# EAGLE design USBSocket_Type9_v1.0 (EAGLE 9.6.2)
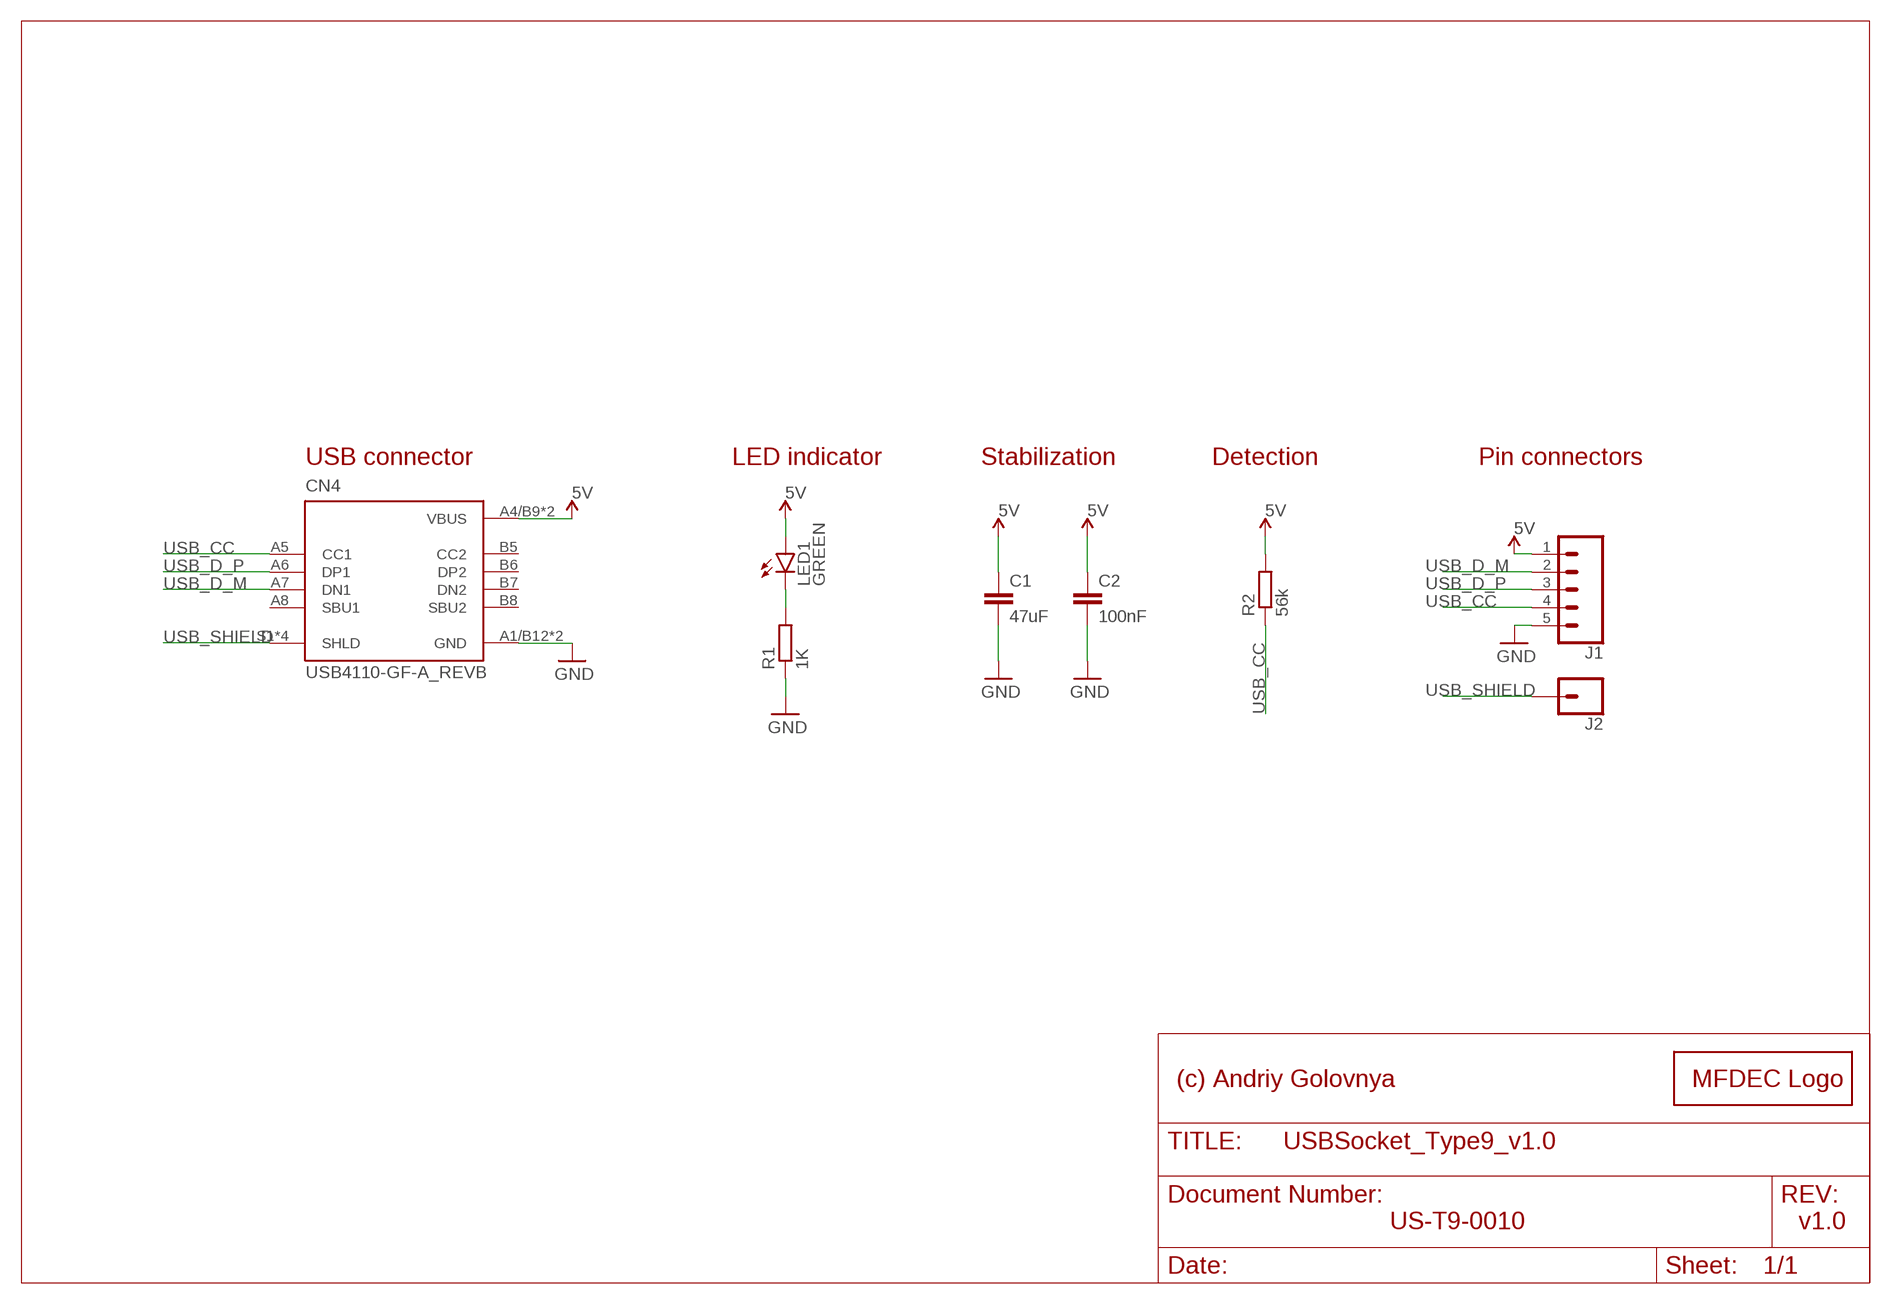
[diagram p0: schematic, sheet 1]

## Parts
C1  47uF  C-EUC0805  [C0805]
C2  100nF  C-EUC0402  [C0402]
CN4  USB4110-GF-A_REVB  [GCT_USB4110-GF-A_REVB]
J1  CONN_05PTH  [1X05]
J2  CONN_01  [1X01]
LED1  GREEN  LEDSML0603  [SML0603]
LOGO1  MFDECLOGO_L_10MM  [MFDEC_L_10MM]
R1  1K  R-EU_R0402  [R0402]
R2  56k  R-EU_R0402  [R0402]

## Nets
5V [POWER]: C1.1 C2.1 CN4.A4/B9(VBUS) CN4.B4/A9(VBUS) J1.1 LED1.A R2.2
GND [POWER]: C1.2 C2.2 CN4.A1/B12(GND) CN4.B1/A12(GND) J1.5 R1.1
N$7: LED1.C R1.2
USB_CC: CN4.A5(CC1) J1.4 R2.1
USB_D_M [XUSB]: CN4.A7(DN1) J1.2
USB_D_P [XUSB]: CN4.A6(DP1) J1.3
USB_SHIELD: CN4.S1(SHLD) CN4.S2(SHLD) CN4.S3(SHLD) CN4.S4(SHLD) J2.1
Unconnected: CN4.A8(SBU1) CN4.B5(CC2) CN4.B6(DP2) CN4.B7(DN2) CN4.B8(SBU2)

## Notes on the sheet
- USB connector | LED indicator | Stabilization | Detection | Pin connectors
- (c) Andriy Golovnya
- US-T9-0010 | v1.0

## Library data of the parts
C1 C2 = rcl:C-EU: CAPACITOR, European symbol; SPICEPREFIX: C
CN4 = USB4110-GF-A_REVB:USB4110-GF-A_REVB: Check availability <https://pricing.snapeda.com/parts/USB4110-GF-A/GCT/view-part?ref=eda>; AVAILABILITY: In Stock; DESCRIPTION: USB-C (USB TYPE-C) USB 2.0 Receptacle Connector 24 (16+8 Dummy) Position Surface Mount, Right Angle; Through Hole; MF: GCT; MP: USB4110-GF-A; PACKAGE: None; PRICE: None; PURCHASE-URL: https://pricing.snapeda.com/search/part/USB4110-GF-A/?ref=eda
J1 = _my_locked_connectors:CONN_05: Multi connection point. Often used as Generic Header-pin footprint for 0.1 inch spaced/style header connections On any of the 0.1 inch spaced packages, you can populate with these: Break Away Headers - Straight <https://www.sparkfun.com/products/116> (PRT-00116) Break Away Male Headers - Right Angle <https://www.sparkfun.com/products/553> (PRT-00553) Female Headers <https://www.sparkfun.com/products/115> (PRT-00115) Break Away Headers - Machine Pin <https://www.sparkfun.com/products/117> (PRT-00117) Break Away Female Headers - Swiss Machine Pin <https://www.sparkfun.com/products/743> (PRT-00743) For SCREWTERMINALS and SPRING TERMINALS visit here: Screw Terimnals on SparkFun.com <https://www.sparkfun.com/search/results?term=Screw+Terminals> (5mm/3.5mm/2.54mm spacing) This device is also useful as a general connection point to wire up your design to another part of your project. Our various solder wires solder well into these plated through hole pads. Hook-Up Wire - Assortment (Stranded, 22 AWG) <https://www.sparkfun.com/products/11375> (PRT-11375) Hook-Up Wire - Assortment (Solid Core, 22 AWG) <https://www.sparkfun.com/products/11367> (PRT-11367) View the entire wire category on our website here <https://www.sparkfun.com/categories/141> Special notes: Molex polarized connector foot print use with SKU : PRT-08231 with associated crimp pins and housings. 1MM SMD Version SKU: PRT-10208
J2 = SparkFun-Connectors:CONN_01: Single connection point. Often used as Generic Header-pin footprint for 0.1 inch spaced/style header connections On any of the 0.1 inch spaced packages, you can populate with these: Break Away Headers - Straight <https://www.sparkfun.com/products/116> (PRT-00116) Break Away Male Headers - Right Angle <https://www.sparkfun.com/products/553> (PRT-00553) Female Headers <https://www.sparkfun.com/products/115> (PRT-00115) Break Away Headers - Machine Pin <https://www.sparkfun.com/products/117> (PRT-00117) Break Away Female Headers - Swiss Machine Pin <https://www.sparkfun.com/products/743> (PRT-00743) This device is also useful as a general connection point to wire up your design to another part of your project. Our various solder wires solder well into these plated through hole pads. Hook-Up Wire - Assortment (Stranded, 22 AWG) <https://www.sparkfun.com/products/11375> (PRT-11375) Hook-Up Wire - Assortment (Solid Core, 22 AWG) <https://www.sparkfun.com/products/11367> (PRT-11367) View the entire wire category on our website here <https://www.sparkfun.com/categories/141> Special notes: SMTSO-256-ET is a "flush mount" nut for a 4-40 screw. We mostly use this on specialty testbeds; it is a nice way to connect hardware to your PCB at an adjustable hieght. Also note, the SNAP packages are for using a snappable style connector. We sell a baggie of snaps and they are also used on two LilyPad designs: Snap Assortment - 30 pack (male and female) <https://www.sparkfun.com/products/11347> (DEV-11347) LilyPad Arduino SimpleSnap <https://www.sparkfun.com/products/10941> (DEV-10941) LilyPad SimpleSnap Protoboard <https://www.sparkfun.com/products/10940> (DEV-10940)
LED1 = led:LED: LED OSRAM: - CHIPLED LG R971, LG N971, LY N971, LG Q971, LY Q971, LO R971, LY R971 LH N974, LH R974 LS Q976, LO Q976, LY Q976 LO Q996 - Hyper CHIPLED LW Q18S LB Q993, LB Q99A, LB R99A - SideLED LS A670, LO A670, LY A670, LG A670, LP A670 LB A673, LV A673, LT A673, LW A673 LH A674 LY A675 LS A676, LA A676, LO A676, LY A676, LW A676 LS A679, LY A679, LG A679 - Hyper Micro SIDELED® LS Y876, LA Y876, LO Y876, LY Y876 LT Y87S - SmartLED LW L88C, LW L88S LB L89C, LB L89S, LG L890 LS L89K, LO L89K, LY L89K LS L896, LA L896, LO L896, LY L896 - TOPLED LS T670, LO T670, LY T670, LG T670, LP T670 LSG T670, LSP T670, LSY T670, LOP T670, LYG T670 LG T671, LOG T671, LSG T671 LB T673, LV T673, LT T673, LW T673 LH T674 LS T676, LA T676, LO T676, LY T676, LB T676, LH T676, LSB T676, LW T676 LB T67C, LV T67C, LT T67C, LS T67K, LO T67K, LY T67K, LW E67C LS E67B, LA E67B, LO E67B, LY E67B, LB E67C, LV E67C, LT E67C LW T67C LS T679, LY T679, LG T679 LS T770, LO T770, LY T770, LG T770, LP T770 LB T773, LV T773, LT T773, LW T773 LH T774 LS E675, LA E675, LY E675, LS T675 LS T776, LA T776, LO T776, LY T776, LB T776 LHGB T686 LT T68C, LB T68C - Hyper Mini TOPLED® LB M676 - Mini TOPLED Santana® LG M470 LS M47K, LO M47K, LY M47K Source: http://www.osram.convergy.de LUXEON: - LUMILED® LXK2-PW12-R00, LXK2-PW12-S00, LXK2-PW14-U00, LXK2-PW14-V00 LXK2-PM12-R00, LXK2-PM12-S00, LXK2-PM14-U00 LXK2-PE12-Q00, LXK2-PE12-R00, LXK2-PE12-S00, LXK2-PE14-T00, LXK2-PE14-U00 LXK2-PB12-K00, LXK2-PB12-L00, LXK2-PB12-M00, LXK2-PB14-N00, LXK2-PB14-P00, LXK2-PB14-Q00 LXK2-PR12-L00, LXK2-PR12-M00, LXK2-PR14-Q00, LXK2-PR14-R00 LXK2-PD12-Q00, LXK2-PD12-R00, LXK2-PD12-S00 LXK2-PH12-R00, LXK2-PH12-S00 LXK2-PL12-P00, LXK2-PL12-Q00, LXK2-PL12-R00 Source: www.luxeon.com KINGBRIGHT: KA-3528ASYC Source: www.kingbright.com
LOGO1 = _my_logos:MFDECLOGO: Midnight Fog - Digital Eye Candy LOGO
R1 R2 = rcl:R-EU_: RESISTOR, European symbol; SPICEPREFIX: R

## Net classes
1 XUSB: width 0.305 mm
2 USB: width 0.305 mm
3 POWER: width 0.305 mm

## Board
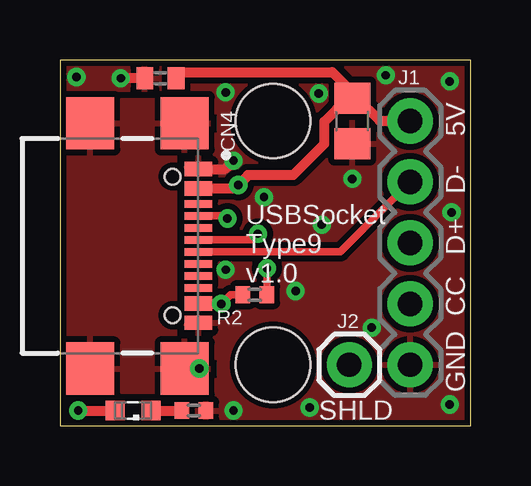
[diagram p1: board, top side]
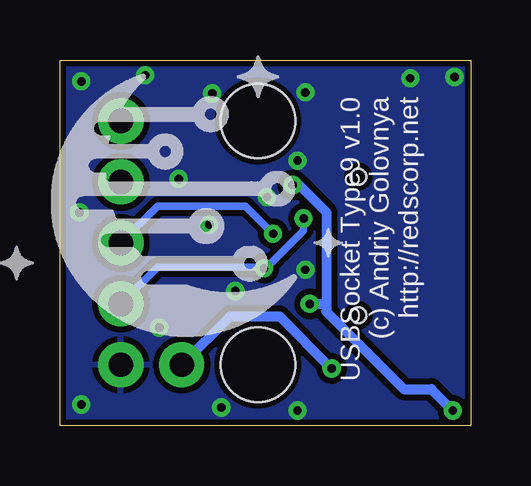
[diagram p2: board, bottom side, seen from below]

Size 17.14 x 15.24 mm. Coordinates in mm from the lower left corner, seen from the top.
Outline: 0,0 17.14,0 17.14,15.24 0,15.24 0,0
Copper layers (1*16): Top 0.035mm / dielectric 1.5mm / Bottom 0.035mm
Design rules "default *": minimum track width 6mil, minimum drill 0.35mm, track to track 6mil, track to pad 6mil, pad to pad 6mil, via to via 6mil, smd to smd 6mil, copper to edge 10mil, drill to drill 6mil, minimum pad ring 10mil, minimum via ring 8mil, stop-mask expansion 4mil, vias tented up to drill 20mil, thermal gap 10mil
Holes 3.1 mm at 8.89,2.54 8.89,12.7

### Footprints (pad centres in the part's own frame; a part is rotated, then mirrored left to right if it is on the bottom)
C0805 = smd 1.3 x 1.5: 1 -0.95,0; 2 0.95,0
C0402 = smd 0.7 x 0.9: 1 -0.65,0; 2 0.65,0
GCT_USB4110-GF-A_REVB = smd 0.6 x 1.15: A1/B12 -3.2,1.075; A4/B9 -2.4,1.075; B1/A12 3.2,1.075; B4/A9 2.4,1.075 | smd 0.3 x 1.15: A5 -1.25,1.075; A6 -0.25,1.075; A7 0.25,1.075; A8 1.25,1.075; B5 1.75,1.075; B6 0.75,1.075; B7 -0.75,1.075; B8 -1.75,1.075 | smd 2.18 x 2: S1 -5.11,0.5; S2 5.11,0.5; S3 -5.11,-3.43; S4 5.11,-3.43 | hole 0.65: -2.89,0; 2.89,0
1X05 = drill 1.016 pad 1.88: 1 0,0; 2 2.54,0; 3 5.08,0; 4 7.62,0; 5 10.16,0
1X01 = drill 1.016 pad 1.88: 1 0,0
SML0603 = smd 0.8 x 0.8: A 0.75,0; C -0.75,0
R0402 = smd 0.6 x 0.7: 1 -0.5,0; 2 0.5,0

### Placement (x,y rotation side)
C1  12.19,12.7 270 top
C2  4.19,14.48 180 top
CN4  4.7,7.49 270 top
J1  14.61,12.7 270 top
J2  12.06,2.54 0 top
LED1  3.05,0.64 180 top
LOGO1  20.45,2.79 0 bottom  (outside the outline)
R1  5.59,0.64 180 top
R2  8.13,5.46 180 top

### Tracks (layer width: path | path; a pad name or v marks a point on that pad's centre or on a via)
5V  (via drill 0.35)
  Top 0.305: v6.73,5.08 7.11,5.46 R2.2
  Top 0.406: C1.1 12,13.65 11.02,12.68 11.02,11.74 9.72,10.44 7.84,10.44 v7.44,10.03 7.3,9.89 CN4.A4/B9 | C2.1 4.84,14.54 5.04,14.73 11.36,14.73 12.19,13.9 C1.1 | C1.1 12.38,13.65 13.34,12.7 J1.1 | CN4.B4/A9 6.72,5.09 v6.73,5.08 | v0.76,0.64 LED1.A
  Bottom 0.406: v7.44,10.03 7.18,10.03 6.04,8.89 6.04,5.08 | 6.04,5.08 6.04,4.75 2.81,1.52 1.65,1.52 v0.76,0.64 | v6.73,5.08 6.04,5.08
GND  (via drill 0.35)
  Top 0.406: C2.2 v2.54,14.48 | CN4.A1/B12 6.88,10.69 v7.24,11.05
  other vias: 13,4.09 7.24,0.64 16.26,0.89 16.26,14.35 16.33,8.89 8.51,9.53 12.19,10.29 6.91,13.89 10.79,13.84 10.41,0.76 13.59,14.61 10.92,8.38 6.91,6.5 9.83,5.61 0.69,14.53
  pour Top (isolate 0.254, rank 2): 0.13,0 23.24,0 23.24,15.24 0.13,15.24
  pour Bottom (isolate 0.254, rank 2): 0.13,0 20.07,0 20.07,15.24 0.13,15.24
N$7
  Top 0.406: LED1.C R1.2
USB_CC  (via drill 0.35)
  Top 0.305: CN4.A5 6.88,8.74 v6.99,8.64 | v8.64,6.56 8.63,6.55 R2.1
  Bottom 0.305: v6.99,8.64 6.99,8.13 8.51,6.6 8.64,6.6 | J1.4 13.08,6.6 8.64,6.6 | v8.64,6.56 8.64,6.6
USB_D_M
  Top 0.305: J1.2 11.69,7.24 CN4.A7
USB_D_P  (via drill 0.35)
  Top 0.305: CN4.A6 8,7.74 v8.26,8
  Bottom 0.305: v8.26,8 9.4,9.14 13.08,9.14 J1.3
USB_SHIELD  (via drill 0.35)
  Top 0.406: v5.81,2.38 CN4.S2
  Bottom 0.406: v5.81,2.38 7.98,4.55 10.06,4.55 J2.1
  pour Top (isolate 0.254): 4.83,11.43 6.22,11.43 6.22,13.59 0.13,13.59 0.13,1.4 6.22,1.4 6.22,3.56 4.83,3.56

### Text on the board
tPlace: 5V | D- | D+ | USBSocket / Type9 / v1.0 | CC | GND | SHLD
bPlace: USBSocket Type9 v1.0 / (c) Andriy Golovnya / http://redscorp.net